# Altium schematic sheet Sheet1.SchDoc
size A3
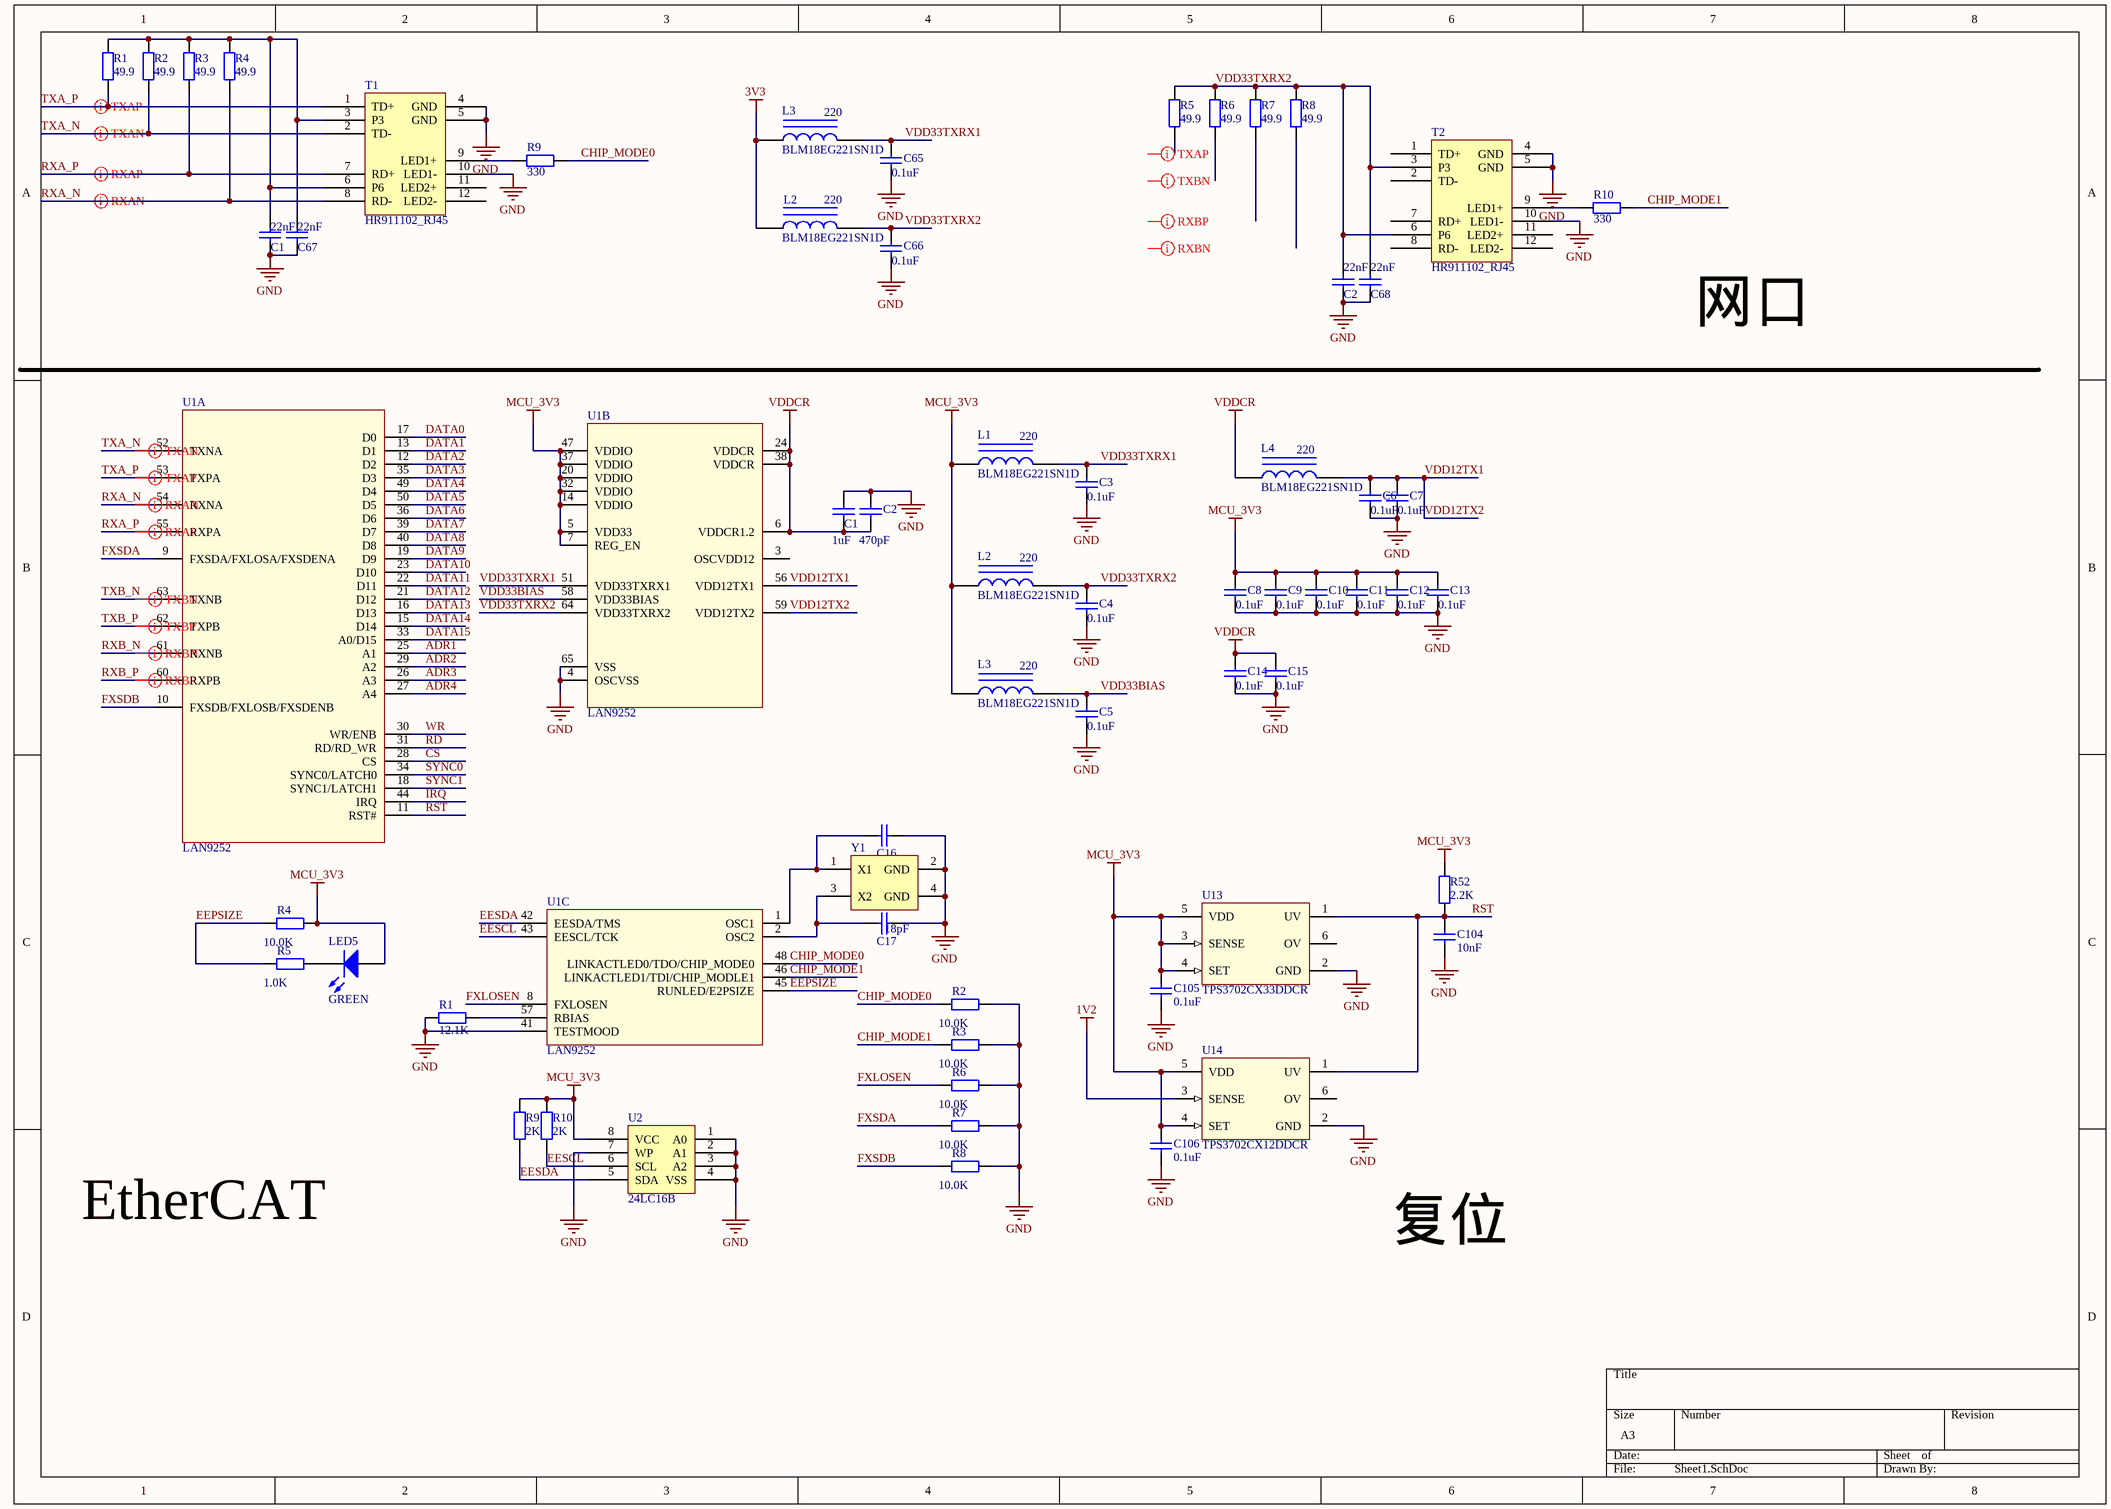
[diagram p0: Sheet1.SchDoc]

## Parts
(Parts that share a designator on the sheet are numbered #1, #2 ... from top to bottom, then left to right.)
C1#1  value 22nF  [CC1608-0603]  (hidden comment: 0603B223J6R3NT)
C1#2  value 1uF  [CC1608-0603]  (hidden comment: 0603B105J6R3NT)
C2#1  value 22nF  [CC1608-0603]  (hidden comment: 0603B223J6R3NT)
C2#2  value 470pF  [CC1005-0402]  (hidden comment: 0402B471J6R3NT)
C3  value 0.1uF  [CC1005-0402]  (hidden comment: 0402B104J6R3NT)
C4  value 0.1uF  [CC1005-0402]  (hidden comment: 0402B104J6R3NT)
C5  value 0.1uF  [CC1005-0402]  (hidden comment: 0402B104J6R3NT)
C6  value 0.1uF  [CC1005-0402]  (hidden comment: 0402B104J6R3NT)
C7  value 0.1uF  [CC1005-0402]  (hidden comment: 0402B104J6R3NT)
C8  value 0.1uF  [CC1005-0402]  (hidden comment: 0402B104J6R3NT)
C9  value 0.1uF  [CC1005-0402]  (hidden comment: 0402B104J6R3NT)
C10  value 0.1uF  [CC1005-0402]  (hidden comment: 0402B104J6R3NT)
C11  value 0.1uF  [CC1005-0402]  (hidden comment: 0402B104J6R3NT)
C12  value 0.1uF  [CC1005-0402]  (hidden comment: 0402B104J6R3NT)
C13  value 0.1uF  [CC1005-0402]  (hidden comment: 0402B104J6R3NT)
C14  value 0.1uF  [CC1005-0402]  (hidden comment: 0402B104J6R3NT)
C15  value 0.1uF  [CC1005-0402]  (hidden comment: 0402B104J6R3NT)
C16  value 18pF  [CC1005-0402]  (hidden comment: 0402B180J6R3NT)
C17  Vaule: 18pF  [CC1005-0402]  (hidden comment: 0402B180J6R3NT)
C65  value 0.1uF  [CC1608-0603]  (hidden comment: 0402B104J6R3NT)
C66  value 0.1uF  [CC1608-0603]  (hidden comment: 0402B104J6R3NT)
C67  value 22nF  [CC1608-0603]  (hidden comment: 0603B223J6R3NT)
C68  value 22nF  [CC1608-0603]  (hidden comment: 0603B223J6R3NT)
C104  value 10nF  [CC1005-0402]  (hidden comment: 0402B103J6R3NT)
C105  value 0.1uF  [CC1005-0402]  (hidden comment: 0402B104J6R3NT)
C106  value 0.1uF  [CC1005-0402]  (hidden comment: 0402B104J6R3NT)
L1  BLM18EG221SN1D  value 220  [BLM0603]
L2#1  BLM18EG221SN1D  value 220  [BLM0603]
L2#2  BLM18EG221SN1D  value 220  [BLM0603]
L3#1  BLM18EG221SN1D  value 220  [BLM0603]
L3#2  BLM18EG221SN1D  value 220  [BLM0603]
L4  BLM18EG221SN1D  value 220  [BLM0603]
LED5  LED Chip  [0603D]  (value not drawn)
R1#1  value 49.9  [CR1608-0603]  (hidden comment: RC03K49R9JT)
R1#2  value 12.1K  [CR1005-0402]  (hidden comment: RC02K1212JT)
R2#1  value 49.9  [CR1608-0603]  (hidden comment: RC03K49R9JT)
R2#2  value 10.0K  [CR1005-0402]  (hidden comment: RC02K6103JT)
R3#1  value 49.9  [CR1608-0603]  (hidden comment: RC03K49R9JT)
R3#2  value 10.0K  [CR1005-0402]  (hidden comment: RC02K6103JT)
R4#1  value 49.9  [CR1608-0603]  (hidden comment: RC03K49R9JT)
R4#2  value 10.0K  [CR1005-0402]  (hidden comment: RC02K6103JT)
R5#1  value 49.9  [CR1608-0603]  (hidden comment: RC03K49R9JT)
R5#2  value 1.0K  [CR1005-0402]  (hidden comment: RC02K6102JT)
R6#1  value 49.9  [CR1608-0603]  (hidden comment: RC03K49R9JT)
R6#2  value 10.0K  [CR1005-0402]  (hidden comment: RC02K6103JT)
R7#1  value 49.9  [CR1608-0603]  (hidden comment: RC03K49R9JT)
R7#2  value 10.0K  [CR1005-0402]  (hidden comment: RC02K6103JT)
R8#1  value 49.9  [CR1608-0603]  (hidden comment: RC03K49R9JT)
R8#2  value 10.0K  [CR1005-0402]  (hidden comment: RC02K6103JT)
R9#1  value 330  [CR1608-0603]  (hidden comment: RC03K331JT)
R9#2  value 2K  [CR1005-0402]  (hidden comment: RC02K202JT)
R10#1  value 330  [CR1608-0603]  (hidden comment: RC03K331JT)
R10#2  value 2K  [CR1005-0402]  (hidden comment: RC02K202JT)
R52  value 2.2K  [CR1005-0402]  (hidden comment: RC02K222JT)
T1  HR911102_RJ45  [RJ45]
T2  HR911102_RJ45  [RJ45]
U1  LAN9252  [LAN9252]  (parts A,B,C of 3)
U2  24LC16B  [24FC512]
U13  TPS3702CX33DDCR  [TPS3702]
U14  TPS3702CX12DDCR  [TPS3702]
Y1  25MHz  [7B-20MHz]  (value not drawn)

## Nets
1V2: U14.3(SENSE)
3V3: L2#1.1 L3#1.1
GND: C1#1.1 C1#2.2 C2#1.1 C2#2.2 C3.1 C4.1 C5.1 C6.1 C7.1 C8.1 C9.1 C10.1 C11.1 C12.1 C13.1 C14.1 C15.1 C16.1 C17.1 C65.1 C66.1 C67.1 C68.1 C104.2 C105.2 C106.2 R1#2.1 R2#2.2 R3#2.2 R6#2.2 R7#2.2 R8#2.2 T1.4(GND) T1.5(GND) T1.10(LED1-) T2.4(GND) T2.5(GND) T2.10(LED1-) U1.4(OSCVSS) U1.41(TESTMOOD) U1.65(VSS) U2.1(A0) U2.2(A1) U2.3(A2) U2.4(VSS) U2.7(WP) U13.2(GND) U14.2(GND) Y1.2(GND) Y1.4(GND)
MCU_3V3: C8.2 C9.2 C10.2 C11.2 C12.2 C13.2 C105.1 C106.1 L1.1 L2#2.1 L3#2.1 LED5.1(A) R4#2.2 R9#2.2 R10#2.2 R52.2 U1.5(VDD33) U1.7(REG_EN) U1.14(VDDIO) U1.20(VDDIO) U1.32(VDDIO) U1.37(VDDIO) U1.47(VDDIO) U2.8(VCC) U13.3(SENSE) U13.4(SET) U13.5(VDD) U14.4(SET) U14.5(VDD)
VDDCR: C1#2.1 C2#2.1 C14.2 C15.2 L4.1 U1.6(VDDCR1.2) U1.24(VDDCR) U1.38(VDDCR)
ADR1: U1.25(A1)
ADR2: U1.29(A2)
ADR3: U1.26(A3)
ADR4: U1.27(A4)
CHIP_MODE0: R2#2.1 R9#1.1 U1.48(LINKACTLED0/TDO/CHIP_MODE0)
CHIP_MODE1: R3#2.1 R10#1.1 U1.46(LINKACTLED1/TDI/CHIP_MODLE1)
CS: U1.28(CS)
DATA0: U1.17(D0)
DATA1: U1.13(D1)
DATA2: U1.12(D2)
DATA3: U1.35(D3)
DATA4: U1.49(D4)
DATA5: U1.50(D5)
DATA6: U1.36(D6)
DATA7: U1.39(D7)
DATA8: U1.40(D8)
DATA9: U1.19(D9)
DATA10: U1.23(D10)
DATA11: U1.22(D11)
DATA12: U1.21(D12)
DATA13: U1.16(D13)
DATA14: U1.15(D14)
DATA15: U1.33(A0/D15)
EEPSIZE: R4#2.1 R5#2.1 U1.45(RUNLED/E2PSIZE)
EESCL: R10#2.1 U1.43(EESCL/TCK) U2.6(SCL)
EESDA: R9#2.1 U1.42(EESDA/TMS) U2.5(SDA)
FXLOSEN: R6#2.1 U1.8(FXLOSEN)
FXSDA: R7#2.1 U1.9(FXSDA/FXLOSA/FXSDENA)
FXSDB: R8#2.1 U1.10(FXSDB/FXLOSB/FXSDENB)
IRQ: U1.44(IRQ)
RD: U1.31(RD/RD_WR)
RST: C104.1 R52.1 U1.11(RST#) U13.1(UV) U14.1(UV)
RXA_N: R4#1.1 T1.8(RD-) U1.54(RXNA)
RXA_P: R3#1.1 T1.7(RD+) U1.55(RXPA)
RXB_N: U1.61(RXNB)
RXB_P: U1.60(RXPB)
SYNC0: U1.34(SYNC0/LATCH0)
SYNC1: U1.18(SYNC1/LATCH1)
TXA_N: R2#1.1 T1.2(TD-) U1.52(TXNA)
TXA_P: R1#1.1 T1.1(TD+) U1.53(TXPA)
TXB_N: U1.63(TXNB)
TXB_P: U1.62(TXPB)
VDD12TX1: C6.2 C7.2 L4.2 U1.56(VDD12TX1) U1.59(VDD12TX2)  [also labelled VDD12TX2]
VDD33BIAS: C5.2 L3#2.2 U1.58(VDD33BIAS)
VDD33TXRX1: C3.2 C65.2 L1.2 L3#1.2 U1.51(VDD33TXRX1)
VDD33TXRX2: C2#1.2 C4.2 C66.2 C68.2 L2#1.2 L2#2.2 R5#1.2 R6#1.2 R7#1.2 R8#1.2 T2.3(P3) T2.6(P6) U1.64(VDD33TXRX2)
WR: U1.30(WR/ENB)
NetC1#1_2: C1#1.2 C67.2 R1#1.2 R2#1.2 R3#1.2 R4#1.2 T1.3(P3) T1.6(P6)
NetC16_2: C16.2 U1.1(OSC1) Y1.1(X1)
NetC17_2: C17.2 U1.2(OSC2) Y1.3(X2)
NetLED5_2: LED5.2(K) R5#2.2
NetR1#2_2: R1#2.2 U1.57(RBIAS)
NetR9#1_2: R9#1.2 T1.9(LED1+)
NetR10#1_2: R10#1.2 T2.9(LED1+)

Not connected (* = marked no-connect by the designer): R5#1 1; R6#1 1; R7#1 1; R8#1 1; T1 11(LED2+) 12(LED2-); T2 1(TD+) 2(TD-) 7(RD+) 8(RD-) 11(LED2+) 12(LED2-); U1 3(OSCVDD12); U13 6(OV); U14 6(OV)

## Layout directives
differential pair: (no net found under the mark), RXA_N, RXA_P, RXB_N, RXB_P, TXA_N, TXA_P, TXB_N, TXB_P

## Notes on the sheet
- 网口
- EtherCAT
- 复位
- (in symbol LED Chip) GREEN

## Library data of the parts
C1#1 C1#2 C2#1 C2#2 C3-C17 C65-C68 C104-C106 = CAP
L1 L2#1 L2#2 L3#1 L3#2 L4 = Inductor Iron: Magnetic-Core Inductor; Published: *; Revision: *; Publisher: *
LED5 = LED Chip: Typical Chip LED; Published: 8-Jun-2000; Revision: July-2002: Re-released for DXP Platform.; Publisher: Altium Limited
R1#1 R1#2 R2#1 R2#2 R3#1 R3#2 R4#1 R4#2 R5#1 R5#2 R6#1 R6#2 R7#1 R7#2 R8#1 R8#2 R9#1 R9#2 R10#1 R10#2 R52 = Resistor
U13 U14 = TPS3702CX33DDCR: Imported; Alternate PartNumber: TPS3702CX33DDCT; Manufacturer: Texas Instruments; CompType: IC; PIN_COUNT: 6; PartNumber: TPS3702CX33DDCR; PackageReference: DDC0006A; MountType: SMT; RefDes: RefDes; Type: DEV; Value: Value
Y1 = XTAL1